# Altium project SaraKit_MainBoard.PrjPcb (part 3 of 3)

## Sheet Accelerometer.SchDoc
size A4; SheetNumber: 6; SheetTotal: 6
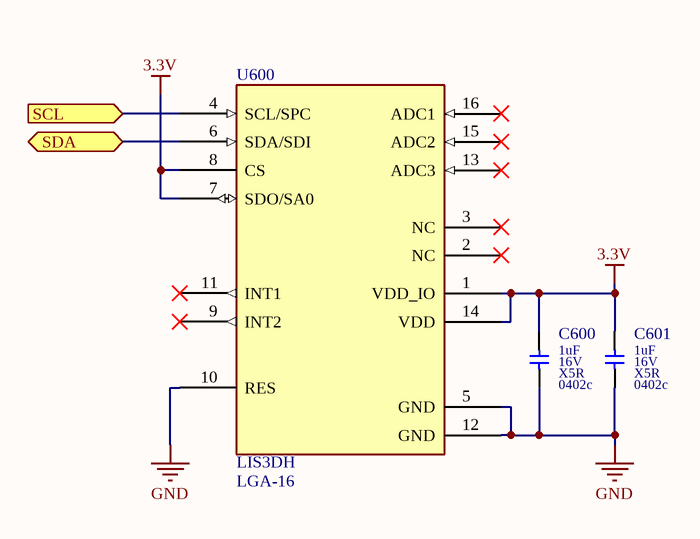
[diagram p5: Accelerometer.SchDoc]

### Parts
C600  11 Parameter 4: X5R  07 Package: 0402c  08 Parameter 1: 1uF  09 Parameter 2: 16V  [CAPC1005X60L]  (hidden comment: CL05A105KO5NNNC)
C601  11 Parameter 4: X5R  07 Package: 0402c  08 Parameter 1: 1uF  09 Parameter 2: 16V  [CAPC1005X60L]  (hidden comment: CL05A105KO5NNNC)
U600  07 Package: LGA-16  [LGA16R50P5X3_300X300X100]  (hidden comment: LIS3DH)

### Ports
SCL (in), SDA (bidir)

### Nets
3.3V: C600.2 C601.2 U600.1(VDD_IO) U600.7(SDO/SA0) U600.8(CS) U600.14(VDD)
GND: C600.1 C601.1 U600.5(GND) U600.10(RES) U600.12(GND)
G2/I2C3_SDA: U600.6(SDA/SDI) ; port SDA
G3/I2C3_SCL: U600.4(SCL/SPC) ; port SCL

Not connected (* = marked no-connect by the designer): U600 2(NC)* 3(NC)* 9(INT2)* 11(INT1)* 13(ADC3)* 15(ADC2)* 16(ADC1)*

### Notes on the sheet
- Version:
- SVN Rev:
- Sheet:
- File:
- Modification Date:
- Variant:
- of
- Sheet Size:
- A4
- SaraAI

### Library data of the parts
C600 C601 = 155: SMT 0402c 1uF 16V 10% X5R 11.9MHz 85'C; 03 Manufacturer: Samsung; 00 Index: 155; 01 Name: CAPACITOR THICK FILM CL05A105KO5NNNC Samsung; 05 Sub Group: THICK FILM; 04 Main Group: CAPACITOR; 06 Assembly: SMT; 12 Parameter 5: 11.9MHz; 13 Parameter 6: 85'C; 14 Modification Date: 16.11.2020; ComponentLink1Description: DATASHEET; ComponentLink1URL: E:\Praca\Mindsailors\Mindsailors Altium\Database Library\Datasheets\CAPACITOR\Samsung CL05A105KO5NNN.pdf; 02 MPN: CL05A105KO5NNNC; 10 Parameter 3: 10%
U600 = 158: SMT LGA-16 ACCELEROMETER 1.71V - 3.6V +/- 16g; 03 Manufacturer: STMicroelectronics; 00 Index: 158; 01 Name: IC SENSOR LIS3DH STMicroelectronics; 04 Main Group: IC; 05 Sub Group: SENSOR; 12 Parameter 5: +/- 16g; 06 Assembly: SMT; 11 Parameter 4: 1.71V - 3.6V; 14 Modification Date: 18.12.2020; ComponentLink1Description: DATASHEET; ComponentLink1URL: E:\Praca\Mindsailors\Mindsailors Altium\Database Library\Datasheets\IC\ST lis3dh.pdf; 08 Parameter 1: ACCELEROMETER; 02 MPN: LIS3DH

## Nets that join several sheets
3.3V: Main (13 pins), Audio (Q200.2 R222.2), MotorsController (18 pins), PSU (7 pins), Accelerometer (6 pins)
5V: Main (12 pins), Audio (C203.2 U200.1), PSU (10 pins)
GND: Main (81 pins), Audio (46 pins), Audio_SpeakerDriver (20 pins), MotorsController (46 pins), PSU (21 pins), Accelerometer (5 pins)
VIN: Main (J105.1 J105.2), Audio_SpeakerDriver (14 pins), MotorsController (R400.1 U401.4), PSU (7 pins)
~{G7/SPI0_CE1}: Main (J100.37), MotorsController (U402.17)
~{G8/SPI0_CE0}: Main (J100.39), Audio (R206.1 U204.53)
~{G16/DSP_RESET}: Main (J100.29), Audio (R202.2 U204.15)
~{G17/PIC_RST}: Main (J100.50), MotorsController (5 pins)
~{G26/DSP_PWR}: Main (J100.24), Audio (Q200.1 R222.1)
AUDIO_AMP_LN: Audio (U204.6), Audio_SpeakerDriver (R310.1)
AUDIO_AMP_LP: Audio (U204.7), Audio_SpeakerDriver (R308.1)
AUDIO_AMP_RN: Audio (U204.9), Audio_SpeakerDriver (R309.1)
AUDIO_AMP_RP: Audio (U204.8), Audio_SpeakerDriver (R311.1)
AUDIO_DSP_I2S1_DI: Main (R108.1), Audio (U204.31)
G2/I2C3_SDA: Main (J100.58 J104.1 R106.1), Accelerometer (U600.6)
G3/I2C3_SCL: Main (J100.56 J104.3 R105.1), Accelerometer (U600.4)
G4/AMP_SHD: Main (J100.54), Audio_SpeakerDriver (R301.1)
G9/SPI0_MISO: Main (J100.40), Audio (R207.1), MotorsController (U402.13)
G10/SPI0_MOSI: Main (J100.44), Audio (U204.55), MotorsController (U402.12)
G11/SPI0_SCK: Main (J100.38), Audio (U204.52), MotorsController (U402.16)
G12/DSP_IRQ: Main (J100.31), Audio (R205.1 U204.57)
G18/PCM_CLK: Main (J100.49), Audio (R200.2 R208.2)
G19/PCM_FS: Main (J100.26), Audio (R201.2)
G20/PCM_DIN: Main (J100.27), Audio (R203.2)
G27/AUDIO_BOOT: Main (J100.48), Audio (R215.1 R216.1 U204.36)
MOT_ACC_SCL: Main (J102.31), MotorsController (U402.27)
MOT_ACC_SDA: Main (J102.33), MotorsController (U402.28)

## Assembly variants
Standard: not fitted C201 C202 C206 C207 C508 C? D500 D501 D503 J501 R209 R302 R304 R500 R501 R502 R503 R506 R512 R? R? R? R? R? U202 U203